# EAGLE schematic 4ButtonSwitch.ItsyBitsyM0.Rev1.0 (EAGLE 8.6.0)
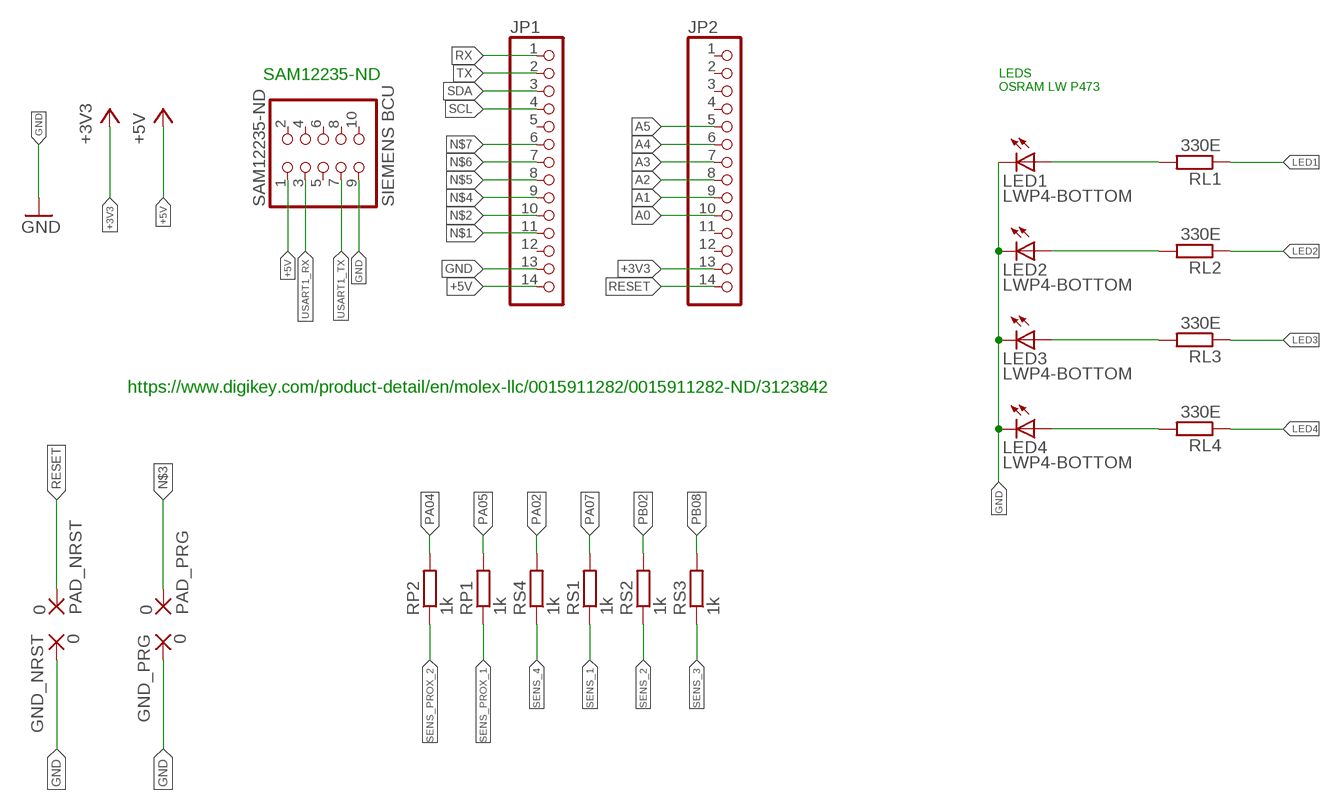
[diagram p0: schematic, sheet 1]

## Parts
GND_NRST  0  SMD5  [SMD2,54-5,08]
GND_PRG  0  SMD5  [SMD2,54-5,08]
JP1  PINHD-1X141X14_SMT  [1X14_SMT]
JP2  PINHD-1X141X14_SMT  [1X14_SMT]
LED1  LWP4-BOTTOM  [P47F-BOTTOM]
LED2  LWP4-BOTTOM  [P47F-BOTTOM]
LED3  LWP4-BOTTOM  [P47F-BOTTOM]
LED4  LWP4-BOTTOM  [P47F-BOTTOM]
PAD_NRST  0  SMD5  [SMD2,54-5,08]
PAD_PRG  0  SMD5  [SMD2,54-5,08]
RL1  330E  R-EU_R1206  [R1206]
RL2  330E  R-EU_R1206  [R1206]
RL3  330E  R-EU_R1206  [R1206]
RL4  330E  R-EU_R1206  [R1206]
RP1  1k  R-EU_R1206  [R1206]
RP2  1k  R-EU_R1206  [R1206]
RS1  1k  R-EU_R1206  [R1206]
RS2  1k  R-EU_R1206  [R1206]
RS3  1k  R-EU_R1206  [R1206]
RS4  1k  R-EU_R1206  [R1206]
SAM12235-ND  SIEMENS BCU  PINHD-2X5_2.54-SMD  [2X05SMD]

## Nets
+3V3: JP2.13
+5V: JP1.14 SAM12235-ND.1
A0: JP2.10
A1: JP2.9
A2: JP2.8
A3: JP2.7
A4: JP2.6
A5: JP2.5
GND: GND_NRST.1(P) GND_PRG.1(P) JP1.13 LED1.C LED2.C LED3.C LED4.C SAM12235-ND.9
LED1: RL1.1
LED2: RL2.1
LED3: RL3.1
LED4: RL4.1
N$1: JP1.11
N$2: JP1.10
N$3: PAD_PRG.1(P)
N$4: JP1.9
N$5: JP1.8
N$6: JP1.7
N$7: JP1.6
N$19: LED1.A RL1.2
N$20: LED2.A RL2.2
N$21: LED3.A RL3.2
N$22: LED4.A RL4.2
PA02: RS4.2
PA04: RP2.2
PA05: RP1.2
PA07: RS1.2
PB02: RS2.2
PB08: RS3.2
RESET: JP2.14 PAD_NRST.1(P)
RX: JP1.1
SCL: JP1.4
SDA: JP1.3
SENS_1: RS1.1
SENS_2: RS2.1
SENS_3: RS3.1
SENS_4: RS4.1
SENS_PROX_1: RP1.1
SENS_PROX_2: RP2.1
TX: JP1.2
USART1_RX: SAM12235-ND.3
USART1_TX: SAM12235-ND.7
Unconnected: JP1.5 JP1.12 JP2.1 JP2.2 JP2.3 JP2.4 JP2.11 JP2.12 SAM12235-ND.2 SAM12235-ND.4 SAM12235-ND.5 SAM12235-ND.6 SAM12235-ND.8 SAM12235-ND.10

## Notes on the sheet
- SAM12235-ND
- LEDS
  OSRAM LW P473
- https://www.digikey.com/product-detail/en/molex-llc/0015911282/0015911282-ND/3123842

## Library data of the parts
GND_NRST GND_PRG PAD_NRST PAD_PRG = wirepad:SMD5: SMD PAD
JP1 JP2 = pinhead+:PINHD-1X14: PIN HEADER
LED1-LED4 = led:*P4: PointLED® Enhanced Thinfilm LED TOP & BOTTOM mount LS P47F, LR P47F, LA P47F, LY P47F, LT P4SG, LB P4SG, LW P4SG Source: http://catalog.osram-os.com .. LA_LR_LS_LY_P47F_Pb_free.pdf
RL1-RL4 RP1 RP2 RS1-RS4 = resistor:R-EU_: RESISTOR, European symbol
SAM12235-ND = pinhead:PINHD-2X5: PIN HEADER